# EAGLE design tempSensorAAABat (EAGLE 6.3)
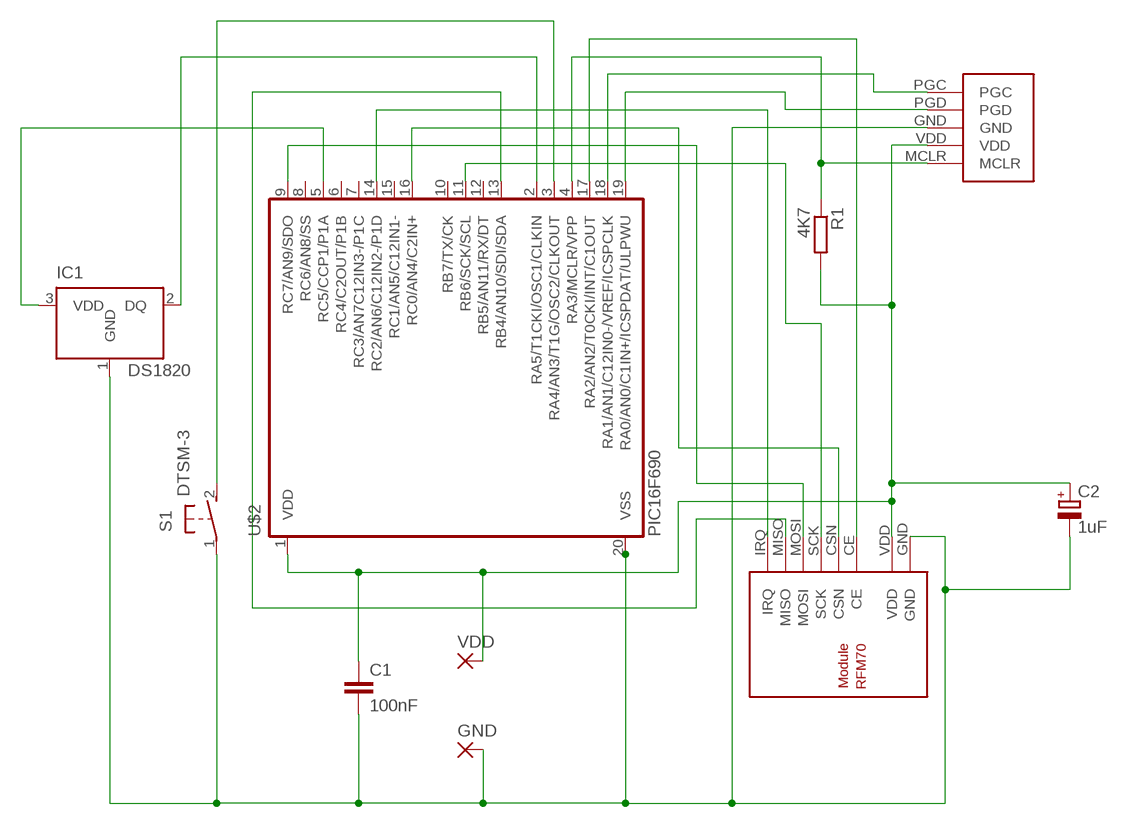
[diagram p0: schematic, sheet 1]

## Parts
C1  100nF  C-EUC2012  [C2012]
C2  1uF  CPOL-EUSMCA  [SMC_A]
GND  SMD5  [SMD2,54-5,08]
IC1  DS1820  [TO-92]
R1  4K7  R-EU_R1206W  [R1206W]
S1  DTSM-3  [DTSM-3]
U$1  RFM70  [RFM70]
U$2  PIC16F690  [SSOP20]
U$3  PROGRAMMINGHEADERDIP  [PROGHEADER]
VDD  SMD5  [SMD2,54-5,08]

## Nets
GND: C1.2 C2.- GND.1(P) IC1.1(GND) S1.1 U$1.GND U$2.20(VSS) U$3.GND
N$1: IC1.2(DQ) U$2.2(RA5/T1CKI/OSC1/CLKIN)
N$2: S1.2 U$2.3(RA4/AN3/T1G/OSC2/CLKOUT)
N$3: IC1.3(VDD) U$2.5(RC5/CCP1/P1A)
N$8: U$2.19(RA0/AN0/C1IN+/ICSPDAT/ULPWU) U$3.PGD
N$11: U$2.18(RA1/AN1/C12IN0-/VREF/ICSPCLK) U$3.PGC
N$12: U$1.MISO U$2.13(RB4/AN10/SDI/SDA)
N$16: U$1.CE U$2.17(RA2/AN2/T0CKI/INT/C1OUT)
N$20: U$1.CSN U$2.16(RC0/AN4/C2IN+)
N$21: U$1.IRQ U$2.14(RC2/AN6/C12IN2-/P1D)
N$22: U$1.SCK U$2.11(RB6/SCK/SCL)
N$23: U$1.MOSI U$2.9(RC7/AN9/SDO)
N$25: R1.1 U$2.4(RA3/MCLR/VPP) U$3.MCLR
VDD: C1.1 C2.+ R1.2 U$1.VDD U$2.1(VDD) U$3.VDD VDD.1(P)
Unconnected: U$2.6(RC4/C2OUT/P1B) U$2.7(RC3/AN7C12IN3-/P1C) U$2.8(RC6/AN8/SS) U$2.10(RB7/TX/CK) U$2.12(RB5/AN11/RX/DT) U$2.15(RC1/AN5/C12IN1-)

## Library data of the parts
C1 = resistor:C-EU: CAPACITOR, European symbol
C2 = resistor:CPOL-EU: POLARIZED CAPACITOR, European symbol
GND VDD = wirepad:SMD5: SMD PAD
IC1 = ds1820:DS1820: DS1820 - 1-Wire Digital Thermometer
R1 = resistor:R-EU_: RESISTOR, European symbol
S1 = switch-tact:DTSM-3
U$1 = rfm70:RFM70: RFM70 2.4 Ghz Funkmodul Autor: Daniel Weber Website: http://projects.web4clans.com Email: daniel.weber@web4clans.com
U$2 = microchip:PIC16F690*: MICROCONTROLLER PIC16F690 18 I/O One 16-bit timer Two 8-bit timer Two comparators Precision internal oscillator-software selectable 8 MHz - 32 KHz SSP w/ I2C Compatible Address mask option EUSART LIN 2.0 Compatible ECCP+ w/ PWM Steering 12 A/D Channels ULPW Enhanced Low Power Timer 1 Timer 1 Gate Synch Latch 4k Program Flash memory 256 bytes SRAM 256 bytes EEPROM
U$3 = rfm70:PROGRAMMINGHEADER

## Board
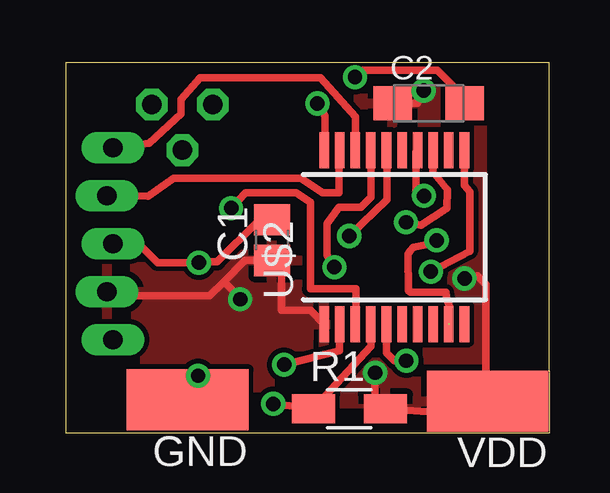
[diagram p1: board, top side]
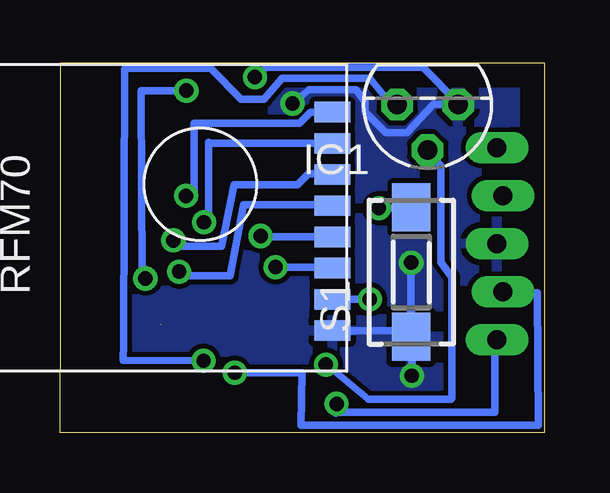
[diagram p2: board, bottom side, seen from below]

Size 20.2 x 15.42 mm. Coordinates in mm from the lower left corner, seen from the top.
Outline: 0.01,0 20.2,0 20.2,2.57 20.17,2.57 20.18,15.42 0,15.41 0.01,0
Copper layers (1*16): Top 0.035mm / dielectric 1.5mm / Bottom 0.035mm
Design rules "default": minimum track width 10mil, minimum drill 24mil, track to track 8mil, track to pad 8mil, pad to pad 8mil, via to via 8mil, smd to smd 8mil, copper to edge 40mil, drill to drill 8mil, minimum pad ring 10mil, minimum via ring 8mil, stop-mask expansion 4mil, vias tented up to drill 0mil, thermal gap 10mil

### Footprints (pad centres in the part's own frame; a part is rotated, then mirrored left to right if it is on the bottom)
C2012 = smd 1.3 x 1.5: 1 -0.85,0; 2 0.85,0
SMC_A = smd 1.6 x 1.4: + -1.5,0; - 1.5,0
SMD2,54-5,08 = smd 2.54 x 5.08: 1 0,0
TO-92 = drill 0.813 pad 1.27 octagon: 1 -1.27,0; 2 0,1.905; 3 1.27,0
R1206W = smd 1.8 x 1.2: 1 -1.499,0; 2 1.499,0
DTSM-3 = smd 2 x 1.6: 1 -2.7,0; 2 2.7,0
RFM70 = smd 0.85 x 1.5: CE 2.5,-14.3; CSN 3.8,-14.3; GND -0.1,-14.3; IRQ 9,-14.3; MISO 7.7,-14.3; MOSI 6.4,-14.3; SCK 5.1,-14.3; VDD 1.2,-14.3
SSOP20 = smd 0.4 x 1.5: 1 -2.925,-3.625; 2 -2.275,-3.625; 3 -1.625,-3.625; 4 -0.975,-3.625; 5 -0.325,-3.625; 6 0.325,-3.625; 7 0.975,-3.625; 8 1.625,-3.625; 9 2.275,-3.625; 10 2.925,-3.625; 11 2.925,3.625; 12 2.275,3.625; 13 1.625,3.625; 14 0.975,3.625; 15 0.325,3.625; 16 -0.325,3.625; 17 -0.975,3.625; 18 -1.625,3.625; 19 -2.275,3.625; 20 -2.925,3.625
PROGHEADER = drill 0.8 long: GND 0,0; MCLR -4,0; PGC 4,0; PGD 2,0.25; VDD -2,0.25

### Placement (x,y rotation side)
C1  8.61,8.03 90 top
C2  15.14,13.73 0 top
GND  5.09,1.37 90 top
IC1  4.87,13.68 180 bottom
R1  11.84,1 0 top
S1  5.55,6.7 90 bottom
U$1  23.15,4.36 90 bottom
U$2  13.71,8.15 0 top
U$3  1.98,7.88 90 top
VDD  17.6,1.32 90 top

### Tracks (layer width: path | path; a pad name or v marks a point on that pad's centre or on a via)
GND  (via drill 0.6, 0.6 pad 0.3)
  Top 0.305: GND.1 v5.53,2.38 | v10.5,13.72 10.81,13.2 10.81,11.8 U$2.20 | C2.- 16.34,14.27 15.51,15.1 12.41,15.1 v12.07,14.82 | C1.2 8.61,8.8 8.01,8.8 6.32,7.12 5.58,7.12 v5.56,7.09 3.84,7.09 3.11,7.82 2.04,7.82 U$3.GND
  Bottom 0.305: v5.53,2.38 5.55,3.6 | 5.55,3.6 S1.1 | v12.07,14.82 11.62,15.23 5.08,15.23 3.6,13.75 IC1.1 3.67,13.68 4.62,13.68 5.74,12.5 6.6,12.5 7.48,13.37 7.48,13.79 7.85,14.29 9.83,14.29 v10.5,13.72 | U$1.GND 5.56,4.26 | 5.55,3.6 5.55,4.26 5.56,4.26 | 5.56,4.26 v5.56,7.09
  pour Bottom: 0.16,15.24 17.47,15.24 17.47,0.15 0.24,0.15 0.24,15.21
N$1  (via drill 0.6)
  Top 0.305: U$2.2 11.43,3.42 v9.11,2.84
  Bottom 0.305: v9.11,2.84 8.91,2.7 7.34,1.4 4.3,1.4 3.89,1.4 3.87,1.43 3.87,6.48 4.32,7.11 4.32,11.12 4.87,11.68 IC1.2
N$2  (via drill 0.6)
  Top 0.305: v6.91,9.36 7.51,10 9.61,10 10.21,9.6 10.21,6 12.11,6 12.11,4.6 U$2.3
  Bottom 0.305: S1.2 v6.91,9.36
N$3  (via drill 0.6)
  Top 0.305: U$2.5 13.38,3.33 13.71,3 v14.21,3
  Bottom 0.305: v14.21,3 17.57,3.02 17.54,3.71 17.51,15.14 17.46,15.18 13.93,15.18 12.64,13.89 11.69,13.89 10.94,14.77 7.28,14.77 6.4,13.68 IC1.3
N$8
  Top 0.305: U$3.PGD 3.44,9.85 4.51,10.6 9.81,10.6 10.71,10 11.41,10 11.41,11.76 U$2.19
N$11
  Top 0.305: U$3.PGC 3.48,12.06 4.81,13.3 4.81,13.9 5.61,14.8 10.64,14.79 12.09,13.16 12.11,11.8 U$2.18
N$12  (via drill 0.6)
  Top 0.305: v14.2,8.77 14.82,8.65 15.89,9.36 15.92,10.12 15.31,10.88 15.31,11.76 U$2.13
  Bottom 0.305: U$1.MISO 13.97,12.06 14.01,12.1 14.01,9.1 v14.2,8.77
N$16  (via drill 0.6)
  Top 0.305: U$2.17 12.73,9.82 12.31,9.4 11.41,9.4 10.91,8.7 10.91,7.4 v11.21,6.9
  Bottom 0.305: v11.21,6.9 8.89,6.9 U$1.CE
N$20  (via drill 0.6)
  Top 0.305: v11.83,8.2 13.41,9.7 13.41,11.75 U$2.16
  Bottom 0.305: U$1.CSN 11.47,8.16 v11.83,8.2
N$21  (via drill 0.6)
  Top 0.305: v14.95,9.87 14.61,10.1 14.61,11.71 U$2.14
  Bottom 0.305: U$1.IRQ 9.75,13.36 10.21,12.9 14.61,12.9 14.61,10.1 v14.95,9.87
N$22  (via drill 0.6)
  Top 0.305: U$2.11 16.63,10.32 16.85,10.05 16.85,7.57 v15.23,6.71
  Bottom 0.305: v15.23,6.71 15.05,6.59 14.78,6.53 13.1,6.54 12.54,9.5 8.89,9.5 U$1.SCK
N$23  (via drill 0.6)  (1 unrouted)
  Top 0.305: 16.01,4.53 16.04,5.24 15.91,5.57 15.86,5.85 14.38,5.85 14.35,5.87 14.3,5.92 14.29,7.45 14.35,7.57 14.51,7.74 15.13,7.86 v15.48,8.02
  Bottom 0.305: U$1.MOSI 8.81,10.8 9.83,10.8 10.3,10.33 12.93,10.33 13.45,7.78 15.23,7.78 v15.47,8.02 v15.48,8.02
N$25  (via drill 0.6)
  Top 0.305: U$2.4 12.73,3.61 R1.1 v8.66,1.2
  Bottom 0.305: v8.66,1.2 8.7,1.15 8.7,0.85 | 8.7,0.82 8.7,0.85 | 8.7,0.85 2.07,0.86 2.07,3.57 U$3.MCLR
VDD  (via drill 0.6, 0.6 pad 0.3)
  Top 0.305: U$2.1 10.21,5.1 9.01,5.1 9.01,7.18 C1.1 7.49,7.18 6.61,6.29 | 6.61,6.29 6.01,5.7 1.89,5.7 U$3.VDD | v12.91,2.5 12.91,1.1 R1.2 17.12,0.72 VDD.1 17.52,1.4 17.52,6.19 17.18,6.53 v16.64,6.43 | v7.28,5.56 7.28,5.62 6.61,6.29 | C2.+ 14.67,13.73 v14.93,14.26
  Bottom 0.305: v12.91,2.5 10.11,2.5 10.14,0.31 0.26,0.31 0.29,5.84 1.19,5.84 U$3.VDD | U$1.VDD v7.28,5.56 | v14.93,14.26 16.81,14.26 16.81,14.12 16.78,6.51 v16.64,6.43
  pour Top: 0.31,15.17 17.36,15.17 17.36,0.26 0.27,0.26 0.27,15.17